# EAGLE design ArduRCT_Remote-v1 (EAGLE 5.07)
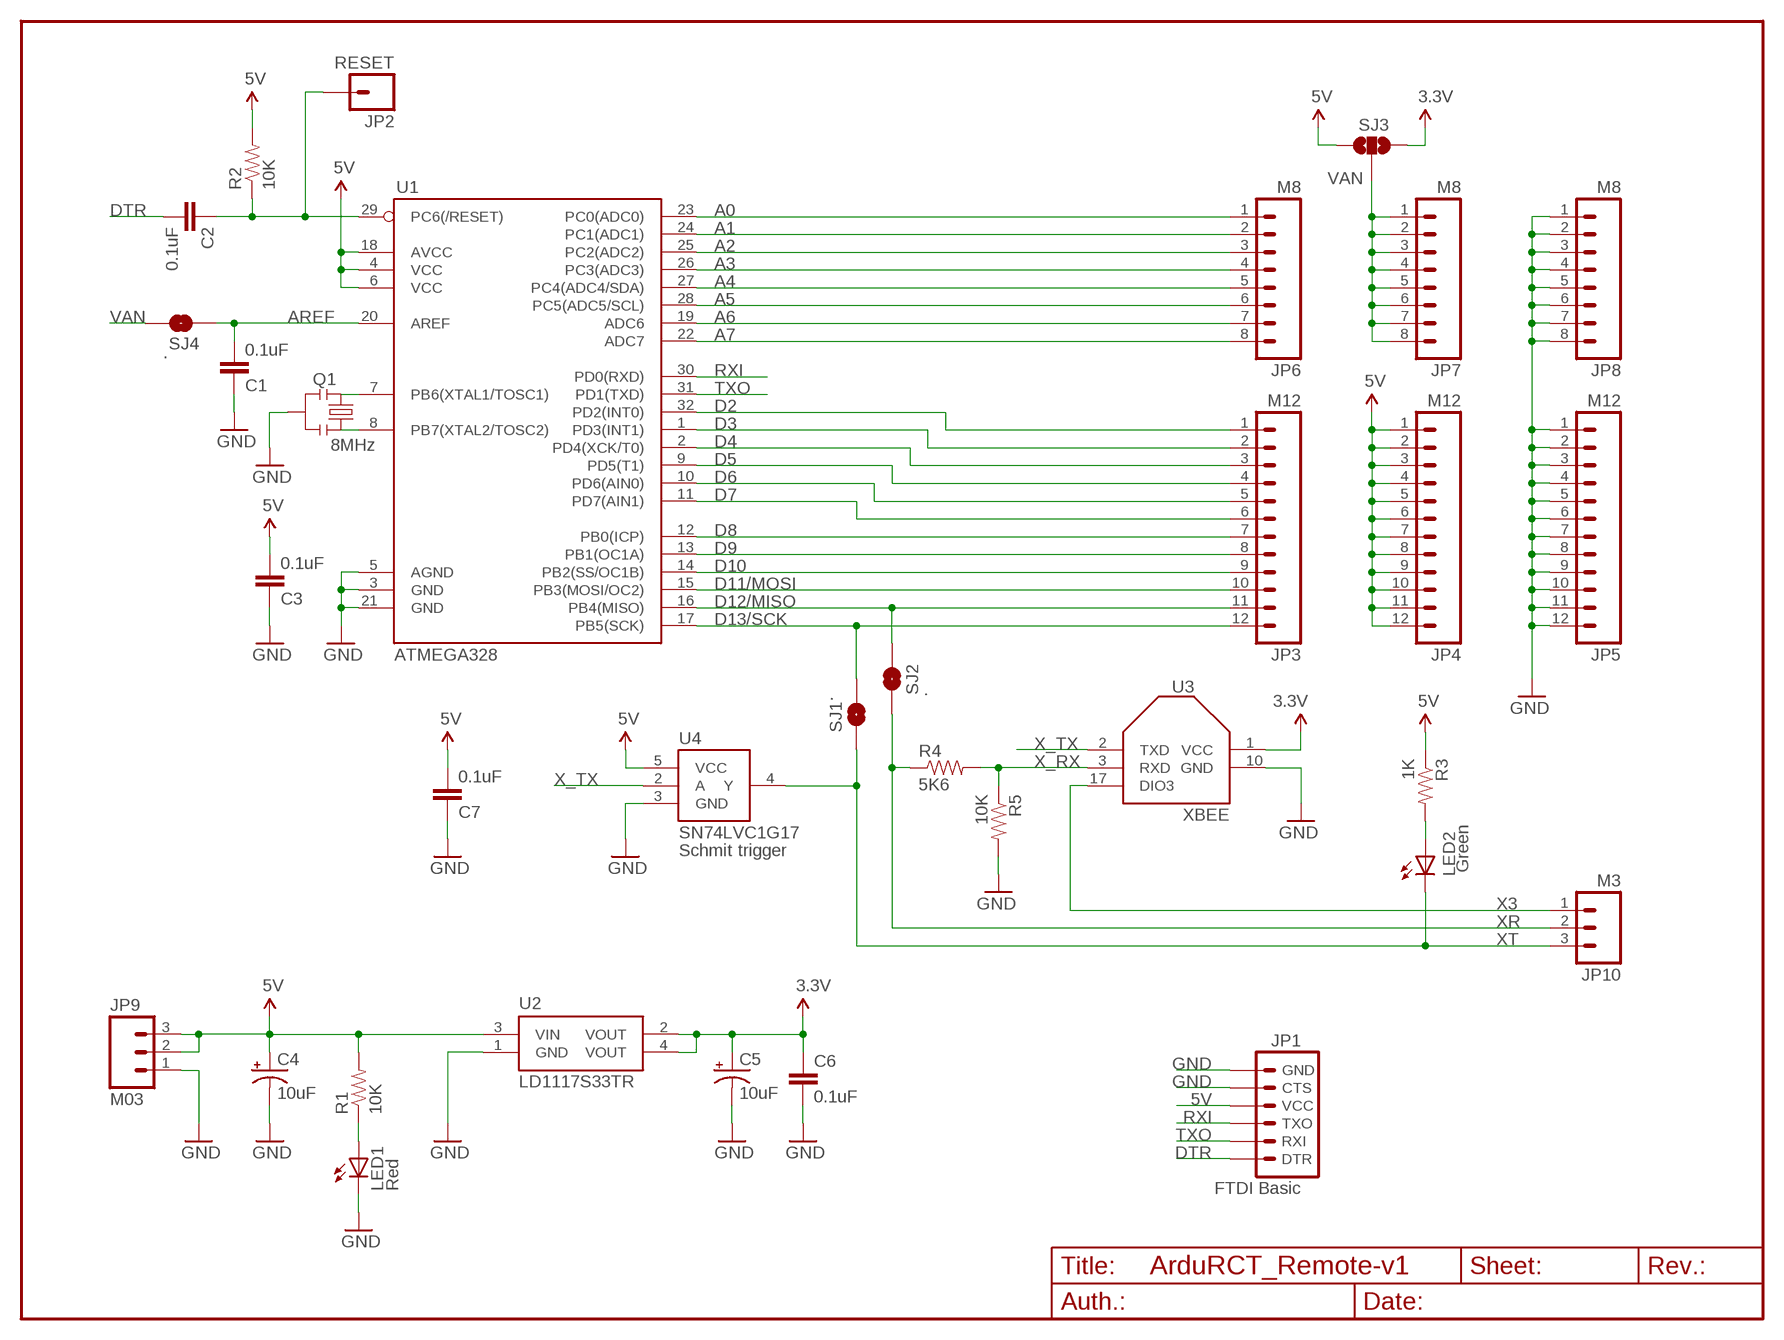
[diagram p0: schematic, sheet 1]

## Parts
C1  0.1uF  CAP0805  [0805]
C2  0.1uF  CAP0805  [0805]
C3  0.1uF  CAP0805  [0805]
C4  10uF  CAP_POL1206  [EIA3216]
C5  10uF  CAP_POL1206  [EIA3216]
C6  0.1uF  CAP0805  [0805]
C7  0.1uF  CAP0805  [0805]
JP1  FTDI Basic  ARDUINO_SERIAL_PROGRAMPTH  [1X06]
JP2  RESET  M01PTH  [1X01]
JP3  M12  M12PTH  [1X12]
JP4  M12  M12PTH  [1X12]
JP5  M12  M12PTH  [1X12]
JP6  M8  M081X08  [1X08]
JP7  M8  M081X08  [1X08]
JP8  M8  M081X08  [1X08]
JP9  M03  [1X3_LONGPAD]
JP10  M3  M03PTH  [1X03]
LED1  Red  LED805  [LED-0805]
LED2  Green  LED805  [LED-0805]
Q1  8MHz  RESONATORSMD  [RESONATOR-SMD]
R1  10K  RESISTOR0805-RES  [0805]
R2  10K  RESISTOR0805-RES  [0805]
R3  1K  RESISTOR0805-RES  [0805]
R4  5K6  RESISTOR0805-RES  [0805]
R5  10K  RESISTOR0805-RES  [0805]
SJ1  .  SOLDERJUMPERTRACE  [SJ_2S-TRACE]
SJ2  .  SOLDERJUMPERTRACE  [SJ_2S-TRACE]
SJ3  SJ_2WAYS_WIDE  [SJ_2WAYS_W]
SJ4  .  SOLDERJUMPERTRACE  [SJ_2S-TRACE]
U1  ATMEGA328  ATMEGA168  [TQFP32-08]
U2  LD1117S33TR  [SOT223]
U3  XBEE  XBEE-SIMPLE  [XBEE-SMD]
U4  SN74LVC1G17  [SOT23-5]

## Nets
3.3V: C5.A(+) C6.1 SJ3.3 U2.2(VOUT) U2.4(VOUT) U3.1(VCC)
5V: C3.2 C4.A(+) C7.2 JP1.4(VCC) JP4.1 JP4.2 JP4.3 JP4.4 JP4.5 JP4.6 JP4.7 JP4.8 JP4.9 JP4.10 JP4.11 JP4.12 JP9.2 JP9.3 R1.2 R2.2 R3.1 SJ3.1 U1.4(VCC) U1.6(VCC) U1.18(AVCC) U2.3(VIN) U4.5(VCC)
A0: JP6.1 U1.23(PC0(ADC0))
A1: JP6.2 U1.24(PC1(ADC1))
A2: JP6.3 U1.25(PC2(ADC2))
A3: JP6.4 U1.26(PC3(ADC3))
A4: JP6.5 U1.27(PC4(ADC4/SDA))
A5: JP6.6 U1.28(PC5(ADC5/SCL))
A6: JP6.7 U1.19(ADC6)
A7: JP6.8 U1.22(ADC7)
AREF: C1.2 SJ4.2 U1.20(AREF)
D2: JP3.1 U1.32(PD2(INT0))
D3: JP3.2 U1.1(PD3(INT1))
D4: JP3.3 U1.2(PD4(XCK/T0))
D5: JP3.4 U1.9(PD5(T1))
D6: JP3.5 U1.10(PD6(AIN0))
D7: JP3.6 U1.11(PD7(AIN1))
D8: JP3.7 U1.12(PB0(ICP))
D9: JP3.8 U1.13(PB1(OC1A))
D10: JP3.9 U1.14(PB2(SS/OC1B))
D11/MOSI: JP3.10 U1.15(PB3(MOSI/OC2))
D12/MISO: JP3.11 SJ2.2 U1.16(PB4(MISO))
D13/SCK: JP3.12 SJ1.1 U1.17(PB5(SCK))
DTR: C2.2 JP1.1(DTR)
GND [vcc]: C1.1 C3.1 C4.C(-) C5.C(-) C6.2 C7.1 JP1.5(CTS) JP1.6(GND) JP5.1 JP5.2 JP5.3 JP5.4 JP5.5 JP5.6 JP5.7 JP5.8 JP5.9 JP5.10 JP5.11 JP5.12 JP8.1 JP8.2 JP8.3 JP8.4 JP8.5 JP8.6 JP8.7 JP8.8 JP9.1 LED1.2(C) Q1.2 R5.2 U1.3(GND) U1.5(AGND) U1.21(GND) U2.1(GND) U3.10(GND) U4.3(GND)
N$1: Q1.1 U1.8(PB7(XTAL2/TOSC2))
N$2: Q1.3 U1.7(PB6(XTAL1/TOSC1))
N$7: LED2.1(A) R3.2
N$38: LED1.1(A) R1.1
RESET: C2.1 JP2.1 R2.1 U1.29(PC6(/RESET))
RXI: JP1.3(TXO) U1.30(PD0(RXD))
TXO: JP1.2(RXI) U1.31(PD1(TXD))
VAN: JP7.1 JP7.2 JP7.3 JP7.4 JP7.5 JP7.6 JP7.7 JP7.8 SJ3.2 SJ4.1
X3: JP10.1 U3.17(DIO3)
X_RX: R4.2 R5.1 U3.3(RXD)
X_TX: U3.2(TXD) U4.2(A)
XR: JP10.2 R4.1 SJ2.1
XT: JP10.3 LED2.2(C) SJ1.2 U4.4(Y)

## Notes on the sheet
- Schmit trigger

## Library data of the parts
C1-C3 C6 C7 = SparkFun:CAP: Capacitor Standard 0603 ceramic capacitor, and 0.1" leaded capacitor.
C4 C5 = SparkFun:CAP_POL: Capacitor Polarized These are standard SMD and PTH capacitors. Normally 10uF, 47uF, and 100uF in electrolytic and tantalum varieties. Always verify the external diameter of the through hole cap, it varies with capacity, voltage, and manufacturer. The EIA devices should be standard.
JP1 = SparkFun:ARDUINO_SERIAL_PROGRAM
JP2 = SparkFun:M01: Header 1 Standard 1-pin 0.1" header. Use with straight break away headers (SKU : PRT-00116), right angle break away headers (PRT-00553), swiss pins (PRT-00743), machine pins (PRT-00117), and female headers (PRT-00115).
JP3-JP5 = SparkFun:M12: Header 12 Standard 12-pin 0.1" header. Use with straight break away headers (SKU : PRT-00116), right angle break away headers (PRT-00553), swiss pins (PRT-00743), machine pins (PRT-00117), and female headers (PRT-00115).
JP6-JP8 = SparkFun:M08: Header 8 Standard 8-pin 0.1" header. Use with straight break away headers (SKU : PRT-00116), right angle break away headers (PRT-00553), swiss pins (PRT-00743), machine pins (PRT-00117), and female headers (PRT-00115).
JP9 = wibauxl:M03
JP10 = SparkFun:M03: Header 3 Standard 3-pin 0.1" header. Use with straight break away headers (SKU : PRT-00116), right angle break away headers (PRT-00553), swiss pins (PRT-00743), machine pins (PRT-00117), and female headers (PRT-00115). Molex polarized connector foot print use with SKU : PRT-08232 with associated crimp pins and housings.
LED1 LED2 = wibauxl:LED
Q1 = SparkFun:RESONATOR: Resonator Small SMD resonator. This is the itty bitty 10/20MHz resonators with built in caps. CSTCE10M0G55 and CSTCE20M0V53. Footprint has been reviewed closely but hasn't been tested yet.
R1-R5 = SparkFun:RESISTOR: Resistor Basic schematic elements and footprints for 0603, 1206, and PTH resistors.
SJ1 SJ2 SJ4 = SparkFun:SOLDERJUMPER: Solder Jumper Standard SMD solder jumper. Used to automate production. Two varients : Normally Open and Normally Closed are the same, but have different paste layers. NC will have a large amount of paste and should jumper during reflow.
SJ3 = wibauxl:SJ_2WAYS
U1 = SparkFun:ATMEGA168
U2 = wibauxl:LD1117S33TR
U3 = wibauxl:XBEE-SIMPLE
U4 = wibauxl:SN74LVC1G17

## Net classes
0 default: width 0.203 mm
1 vcc: width 0.254 mm

## Board
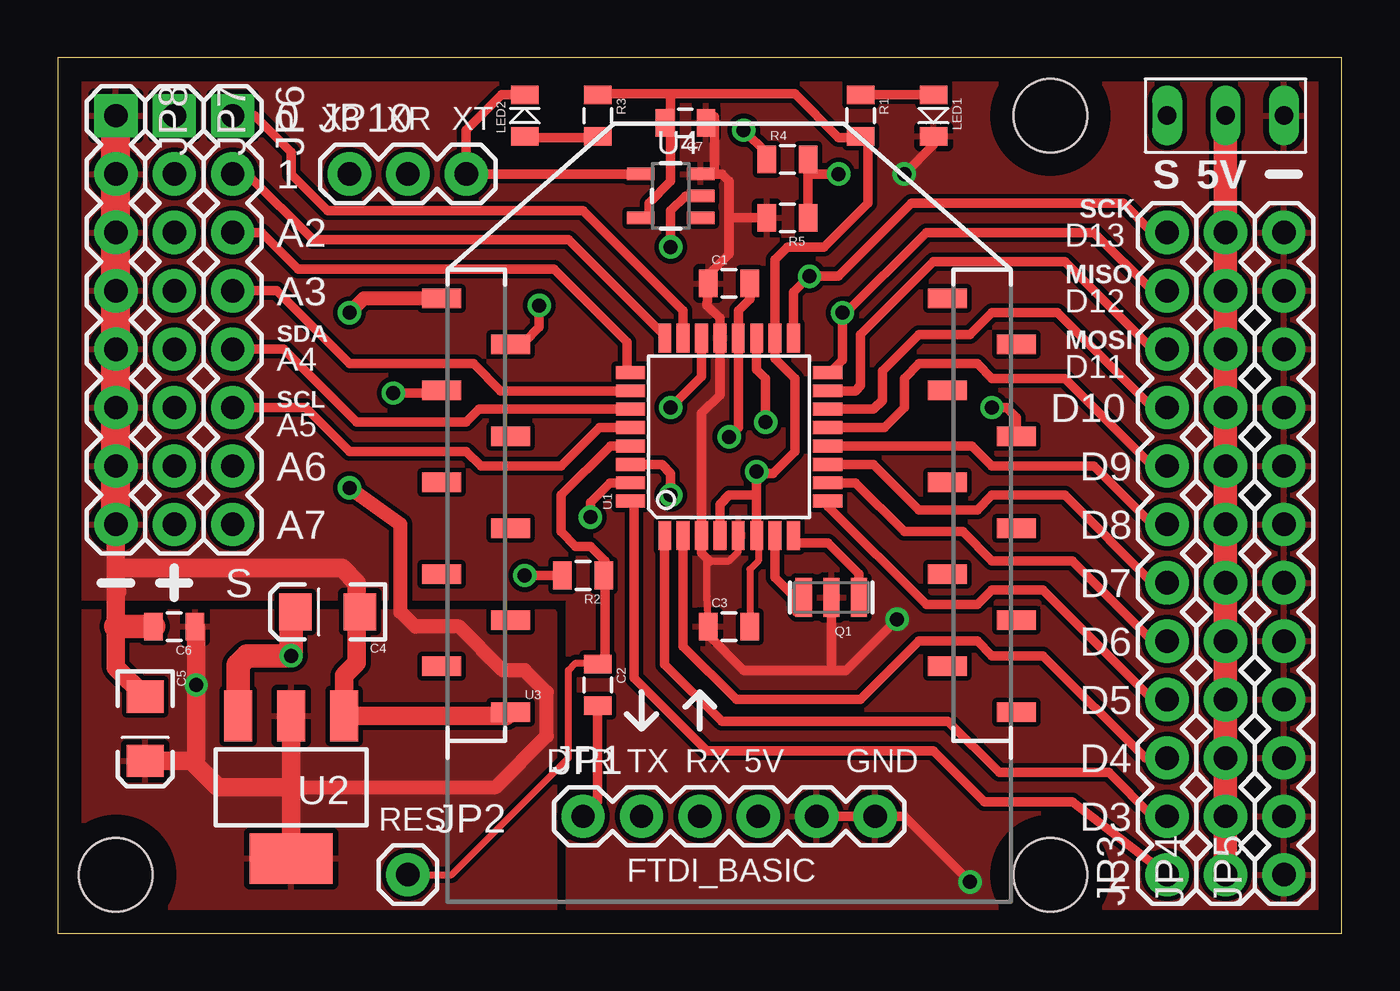
[diagram p1: board, top side]
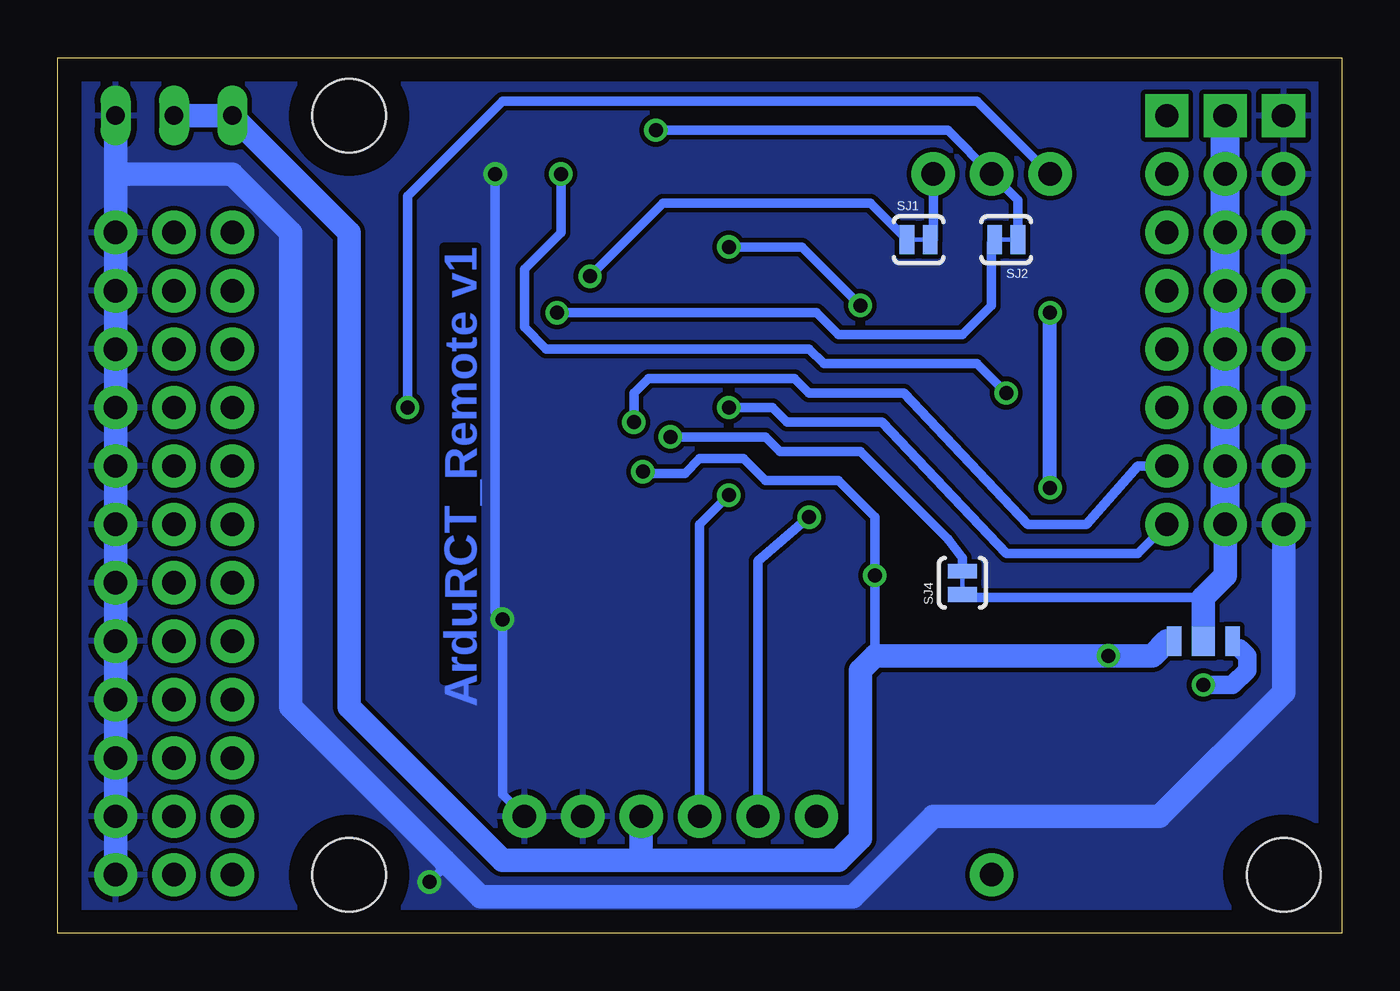
[diagram p2: board, bottom side, seen from below]

Size 55.87 x 38.09 mm. Coordinates in mm from the lower left corner, seen from the top.
Outline: 0,0 55.87,0 55.87,38.09 0,38.09 0,0
Copper layers (1*16): Top 0.035mm / dielectric 1.5mm / Bottom 0.035mm
Design rules "default": minimum track width 10mil, minimum drill 24mil, track to track 8mil, track to pad 8mil, pad to pad 8mil, via to via 8mil, smd to smd 8mil, copper to edge 40mil, drill to drill 8mil, minimum pad ring 10mil, minimum via ring 8mil, stop-mask expansion 4mil, vias tented up to drill 0mil, thermal gap 10mil
Holes 3.2 mm at 43.18,35.56 2.54,2.54 43.18,2.54

### Footprints (pad centres in the part's own frame; a part is rotated, then mirrored left to right if it is on the bottom)
0805 = smd 0.8 x 1.2: 1 -0.9,0; 2 0.9,0
EIA3216 = smd 1.4 x 1.6: A 1.4,0; C -1.4,0
1X06 = drill 1.016 pad 1.88 round: 1 0,0; 2 2.54,0; 3 5.08,0; 4 7.62,0; 5 10.16,0; 6 12.7,0
1X01 = drill 1.016 pad 1.88 round: 1 0,0
1X12 = drill 1.016 pad 1.88 round: 1 0,0; 2 2.54,0; 3 5.08,0; 4 7.62,0; 5 10.16,0; 6 12.7,0; 7 15.24,0; 8 17.78,0; 9 20.32,0; 10 22.86,0; 11 25.4,0; 12 27.94,0
1X08 = drill 1.016 pad 1.88 square: 1 0,0 | drill 1.016 pad 1.88 round: 2 2.54,0; 3 5.08,0; 4 7.62,0; 5 10.16,0; 6 12.7,0; 7 15.24,0; 8 17.78,0
1X3_LONGPAD = drill 0.8 pad 1.27 long: 1 0,0; 2 -2.54,0; 3 -5.08,0
1X03 = drill 1.016 pad 1.88 round: 1 0,0; 2 2.54,0; 3 5.08,0
LED-0805 = smd 0.8 x 1.2: 1 -0.9,0; 2 0.9,0
RESONATOR-SMD = smd 0.7 x 1.7: 1 -1.2,0; 2 0,0; 3 1.2,0
SJ_2S-TRACE = smd 0.635 x 1.27: 1 -0.508,0; 2 0.508,0
SJ_2WAYS_W = smd 0.635 x 1.27: 1 -1.27,0; 3 1.27,0 | smd 1.016 x 1.27: 2 0,0
TQFP32-08 = smd 1.27 x 0.559: 1 -4.293,2.8; 2 -4.293,2; 3 -4.293,1.2; 4 -4.293,0.4; 5 -4.293,-0.4; 6 -4.293,-1.2; 7 -4.293,-2; 8 -4.293,-2.8; 17 4.293,-2.8; 18 4.293,-2; 19 4.293,-1.2; 20 4.293,-0.4; 21 4.293,0.4; 22 4.293,1.2; 23 4.293,2; 24 4.293,2.8 | smd 0.559 x 1.27: 9 -2.8,-4.293; 10 -2,-4.293; 11 -1.2,-4.293; 12 -0.4,-4.293; 13 0.4,-4.293; 14 1.2,-4.293; 15 2,-4.293; 16 2.8,-4.293; 25 2.8,4.293; 26 2,4.293; 27 1.2,4.293; 28 0.4,4.293; 29 -0.4,4.293; 30 -1.2,4.293; 31 -2,4.293; 32 -2.8,4.293
SOT223 = smd 1.219 x 2.235: 1 -2.311,-3.099; 2 0,-3.099; 3 2.311,-3.099 | smd 3.6 x 2.2: 4 0,3.099
XBEE-SMD = smd 1.7 x 0.85: 1 -12.5,20; 2 -9.5,18; 3 -12.5,16; 4 -9.5,14; 5 -12.5,12; 6 -9.5,10; 7 -12.5,8; 8 -9.5,6; 9 -12.5,4; 10 -9.5,2; 11 12.5,2; 12 9.5,4; 13 12.5,6; 14 9.5,8; 15 12.5,10; 16 9.5,12; 17 12.5,14; 18 9.5,16; 19 12.5,18; 20 9.5,20
SOT23-5 = smd 0.55 x 1.2: 1 -0.95,-1.3; 2 0,-1.3; 3 0.95,-1.3; 4 0.95,1.3; 5 -0.95,1.3

### Placement (x,y rotation side)
C1  29.21,28.26 0 top
C2  23.5,10.79 270 top
C3  29.21,13.34 0 top
C4  11.75,13.97 180 top
C5  3.81,8.89 270 top
C6  5.08,13.34 180 top
C7  27.3,35.24 180 top
JP1  22.86,5.08 0 top
JP2  15.24,2.54 0 top
JP3  48.26,2.54 90 top
JP4  50.8,2.54 90 top
JP5  53.34,2.54 90 top
JP6  7.62,35.56 270 top
JP7  5.08,35.56 270 top
JP8  2.54,35.56 270 top
JP9  53.34,35.56 0 top
JP10  12.7,33.02 0 top
LED1  38.1,35.56 270 top
LED2  20.32,35.56 90 top
Q1  33.66,14.61 180 top
R1  34.92,35.56 270 top
R2  22.86,15.56 180 top
R3  23.5,35.56 270 top
R4  31.75,33.66 0 top
R5  31.75,31.11 180 top
SJ1  18.41,30.16 0 bottom
SJ2  14.61,30.16 180 bottom
SJ3  6.03,12.7 0 bottom
SJ4  16.51,15.24 90 bottom
U1  29.21,21.59 90 top
U2  10.16,6.35 180 top
U3  29.21,7.62 0 top
U4  26.67,32.07 90 top

### Tracks (layer width: path | path; a pad name or v marks a point on that pad's centre or on a via)
3.3V  (via drill 0.61)
  Top 0.406: 10.16,6.67 10.48,6.35
  Top 0.61: U3.1 13.33,27.62 v12.7,26.99 | v12.7,19.37 14.92,17.78 14.92,13.97 15.56,13.34 17.46,13.34 19.37,11.43 20.32,11.43 21.27,10.48 21.27,8.57 19.05,6.35 10.48,6.35
  Top 0.813: 5.84,7.49 6.99,6.35 10.16,6.35 | 10.16,6.35 10.16,6.67 U2.2 | 10.16,6.35 U2.4 | C5.A 5.84,7.49 | 5.84,7.49 5.9,7.49 6.03,7.62 v6.03,10.79 6.03,13.28 C6.1
  Bottom 0.406: 4.45,12.38 SJ3.3
  Bottom 0.61: v12.7,19.37 v12.7,26.99
  Bottom 0.813: v6.03,10.79 4.76,10.79 4.13,11.43 4.13,12.06 4.45,12.38
  pour Top: 0.64,13.97 21.59,13.97 21.59,0.64 0.64,0.64
5V  (via drill 0.61)
  Top 0.305: C3.2 30.11,15.82 30.48,16.19 30.48,17.23 U1.6
  Top 0.406: U4.5 25.72,31.12 25.72,31.75 26.67,32.7 26.67,35.24 | 26.67,35.24 26.67,36.2 | 26.67,35.24 C7.2 26.67,35.3 26.67,36.51 | R3.1 23.5,36.51 26.67,36.51 | 26.67,36.51 32.07,36.51 33.97,34.61 34.92,34.61 R1.2 | R1.2 34.98,34.66 | R1.2 35.24,34.61 35.24,31.75 33.34,29.84 31.75,29.84 31.21,29.3 U1.18 31.21,24.99 32.07,24.13 32.07,20.95 31.11,20 30.48,20 v30.41,20.07 30.41,19.05 | U1.4 28.81,18.65 29.21,19.05 30.41,19.05 | 30.41,19.05 U1.6 | v20.32,15.56 R2.2
  Top 1.016: JP4.1 JP4.2 JP4.3 JP4.4 JP4.5 JP4.6 JP4.7 JP4.8 JP4.9 JP4.10 JP4.11 JP4.12 JP9.2 | C4.A 10.48,13.97 10.16,13.65 v10.16,12.06 8.26,12.06 7.85,11.66 U2.3
  Bottom 0.406: v30.41,20.07 30.48,20 28.57,20 27.94,20.64 26.04,20.64 25.08,19.68 21.91,19.68 20.32,18.1 v20.32,15.56 20.32,12.06 19.05,11.75
  Bottom 0.61: 7.62,12.7 SJ3.1
  Bottom 1.016: JP9.2 JP9.3 43.18,30.48 43.18,9.84 36.51,3.17 30.48,3.17 | 30.48,3.17 JP1.4 | 30.48,3.17 21.91,3.17 20.95,4.13 20.95,11.43 20.32,12.06 v10.16,12.06 8.26,12.06 7.62,12.7
A0
  Top 0.406: U1.23 27.21,27.08 22.86,31.43 11.75,31.43 10.16,33.02 10.16,33.97 8.57,35.56 JP6.1
A1
  Top 0.406: U1.24 26.35,25.94 26.35,26.04 22.23,30.16 11.11,30.16 8.26,33.02 JP6.2
A2
  Top 0.406: U1.25 24.77,24.54 24.77,25.72 21.59,28.89 10.48,28.89 8.89,30.48 JP6.3
A3
  Top 0.406: U1.26 19.27,23.59 18.1,24.77 12.7,24.77 9.53,27.94 JP6.4
A4
  Top 0.406: JP6.5 9.84,25.4 13.02,22.23 17.78,22.23 18.34,22.79 U1.27
A5
  Top 0.406: U1.28 23.58,21.99 21.91,20.32 18.41,20.32 17.78,20.95 12.7,20.95 10.79,22.86 JP6.6
A6  (via drill 0.61)
  Top 0.406: U1.19 30.41,24.52 30.8,24.13 v30.8,22.23
  Bottom 0.406: v30.8,22.23 30.8,23.5 30.16,24.13 23.81,24.13 23.18,23.5 19.05,23.5 13.65,17.78 11.11,17.78 8.89,20.32 JP6.7
A7  (via drill 0.61)
  Top 0.406: U1.22 28.01,24.2 v26.67,22.86
  Bottom 0.406: v26.67,22.86 24.77,22.86 24.13,22.23 20,22.23 14.61,16.51 8.89,16.51 JP6.8
AREF  (via drill 0.61)
  Top 0.406: C1.2 30.11,27.57 29.61,27.07 U1.20 29.61,21.99 v29.21,21.59
  Bottom 0.406: v29.21,21.59 25.08,21.59 24.45,20.95 20.95,20.95 17.14,17.14 16.51,16.32 SJ4.2
D2
  Top 0.406: JP3.1 44.13,5.71 40.32,5.71 38.1,7.94 28.26,7.94 25.08,11.11 25.08,18.62 U1.32
D3
  Top 0.406: JP3.2 47.62,5.08 45.72,6.99 40.96,6.99 38.73,9.21 28.89,9.21 26.41,11.69 U1.1
D4
  Top 0.406: U1.2 27.21,12.48 29.53,10.16 34.92,10.16 37.47,12.7 40.01,12.7 40.64,12.06 42.86,12.06 47.31,7.62 JP3.3
D5
  Top 0.406: U1.9 33.5,18.57 37.78,14.29 40.01,14.29 40.64,14.92 42.86,14.92 47.62,10.16 JP3.4
D6
  Top 0.406: U1.10 34.7,19.59 36.83,17.46 39.37,17.46 40.64,16.19 44.13,16.19 47.62,12.7 JP3.5
D7
  Top 0.406: U1.11 35.49,20.39 37.47,18.41 40.01,18.41 40.64,19.05 43.81,19.05 47.62,15.24 JP3.6
D8
  Top 0.406: U1.12 39.77,21.19 40.64,20.32 45.09,20.32 47.62,17.78 JP3.7
D9
  Top 0.406: U1.13 35.96,21.99 36.83,22.86 36.83,24.13 37.47,24.77 40.01,24.77 40.64,24.13 43.81,24.13 47.62,20.32 JP3.8
D10
  Top 0.406: U1.14 35.49,22.79 35.88,23.18 35.88,24.45 37.47,26.04 39.69,26.04 40.64,26.99 43.5,26.99 47.62,22.86 JP3.9
D11/MOSI
  Top 0.406: U1.15 34.7,23.59 34.92,23.81 34.92,26.04 38.1,29.21 43.81,29.21 47.62,25.4 JP3.10
D12/MISO  (via drill 0.61)
  Top 0.406: U1.16 33.66,24.45 34.14,24.93 v34.14,26.99 34.14,26.84 37.78,30.48 45.09,30.48 47.62,27.94 JP3.11
  Bottom 0.406: v34.14,26.99 22.86,26.99 21.91,26.04 16.51,26.04 15.24,27.3 15.24,30.04 SJ2.2
D13/SCK  (via drill 0.61)
  Top 0.406: JP3.12 47.62,30.48 46.35,31.75 37.15,31.75 33.97,28.57 v32.7,28.57 32.01,27.88 U1.17
  Bottom 0.406: v32.7,28.57 29.53,31.75 20.51,31.75 SJ1.1
DTR
  Top 0.406: JP1.1 23.5,5.71 C2.2
GND  (via drill 0.61)
  Top 0.305: U1.5 29.61,16.59 29.21,16.19 28.36,16.19 28.26,16.19 28.26,14.66 C3.1
  Top 0.406: JP1.5 JP1.6 36.83,5.08 v39.69,2.22 | 33.66,11.43 34.29,11.43 v36.51,13.65 | 33.66,11.43 Q1.2 | 33.66,11.43 29.84,11.43 28.31,12.96 C3.1 | 28.31,16.14 28.36,16.19 28.01,16.55 U1.3 28.01,22.61 28.81,23.41 U1.21 28.81,26.75 28.26,27.3 C1.1 28.26,28.63 28.26,28.57 29.21,29.53 29.21,31.11 | C7.1 28.57,35.51 28.57,33.02 28.29,33.05 U4.3 28.89,33.02 29.21,32.7 29.21,31.11 | 29.21,31.11 R5.2 | LED1.2 38.1,34.29 v36.83,33.02
  Top 0.813: U2.1 19.54,9.45 U3.10 | 2.54,14.92 2.54,13.34 2.54,11.56 C5.C | 2.54,14.92 2.54,15.88 | 2.54,15.88 JP8.8 | 2.54,14.92 2.59,14.87 | U2.1 14.53,9.45 | 2.54,15.88 12.38,15.88 13.02,15.24 13.02,14.1 C4.C 13.02,13.84 13.02,11.75 12.47,11.2 U2.1
  Top 1.016: 2.54,13.34 C6.2
  Top 1.27: JP8.1 JP8.2 JP8.3 JP8.4 JP8.5 JP8.6 JP8.7 JP8.8
  Bottom 0.406: JP1.6 36.51,6.03 v36.51,13.65 36.83,13.97 v36.83,33.02 | 39.05,3.17 39.05,2.86 v39.69,2.22
  Bottom 1.016: JP5.1 JP5.2 JP5.3 JP5.4 JP5.5 JP5.6 JP5.7 JP5.8 JP5.9 JP5.10 JP5.11 JP5.12 53.34,33.02 | 53.34,33.02 48.26,33.02 45.72,30.48 45.72,9.84 39.05,3.17 37.47,1.59 21.27,1.59 17.78,5.08 7.94,5.08 2.54,10.48 JP8.8 | 53.34,33.02 JP9.1
  pour Top: 0.64,14.61 22.23,14.61 22.23,0.64 55.24,0.64 55.24,37.47 0.64,37.47
  pour Bottom: 0.64,37.47 0.64,0.64 55.24,0.64 55.24,37.47
N$1
  Top 0.406: U1.8 32.07,17.14 32.23,16.98 33.5,16.98 34.85,15.63 Q1.1
N$2
  Top 0.406: U1.7 31.21,15.46 32.07,14.61 32.14,13.97 Q1.3
N$7
  Top 0.406: R3.2 23.18,34.61 20.37,34.61 LED2.1
N$38
  Top 0.406: R1.1 LED1.1
RESET
  Top 0.305: JP2.1 17.14,2.54 22.23,7.62 22.23,11.43 22.54,11.75 23.44,11.75
  Top 0.406: U1.29 24.05,21.19 21.91,19.05 21.91,17.46 22.54,16.83 23.18,16.83 23.81,16.19 23.76,15.93 R2.1 23.81,14.92 23.81,12.06 C2.1 23.44,11.75
RXI  (via drill 0.61)
  Top 0.406: v26.67,19.05 26.67,20 26.28,20.39 U1.30
  Bottom 0.406: v26.67,19.05 27.94,17.78 JP1.3
TXO  (via drill 0.61)
  Top 0.406: U1.31 24.04,19.59 23.18,18.73 v23.18,18.1
  Bottom 0.406: JP1.2 25.4,16.19 v23.18,18.1
VAN
  Bottom 0.406: 6.03,14.61 16.19,14.61 16.19,14.73 SJ4.1
  Bottom 1.016: SJ3.2 6.03,14.61 5.08,15.56 JP7.8
  Bottom 1.27: JP7.1 JP7.2 JP7.3 JP7.4 JP7.5 JP7.6 JP7.7 JP7.8
X3  (via drill 0.61)
  Top 0.406: U3.17 41.71,22.43 41.27,22.86 v40.64,22.86
  Bottom 0.406: v40.64,22.86 40.64,32.07 36.51,36.2 15.88,36.2 JP10.1
X_RX  (via drill 0.61)
  Top 0.406: v33.97,33.02 32.7,33.02 32.7,33.39 R4.2 R5.1 | v14.61,23.5 16.59,23.5 U3.3
  Bottom 0.406: v33.97,33.02 33.97,30.48 35.56,28.89 35.56,26.35 34.61,25.4 23.18,25.4 22.54,24.77 15.88,24.77 v14.61,23.5
X_TX  (via drill 0.61)
  Top 0.406: U4.2 27.3,32.07 26.67,31.43 v26.67,29.84 | v20.95,27.3 20.95,26.35 20.32,25.72 19.81,25.72 U3.2
  Bottom 0.406: v26.67,29.84 23.5,29.84 v20.95,27.3
XR  (via drill 0.61)
  Top 0.406: R4.1 30.85,33.92 v29.84,34.92
  Bottom 0.406: 13.97,30.16 SJ2.1 14.1,31.88 JP10.2 17.14,34.92 v29.84,34.92
XT
  Top 0.406: LED2.2 19.32,36.46 17.78,34.92 JP10.3 U4.4
  Bottom 0.406: JP10.3 17.78,30.29 SJ1.2 17.78,30.16

### Text on the board
Bottom: ArduRCT_Remote v1
tPlace: 0 | X3 | XR | XT | 1 | S | 5V | SCK | A2 | D13 | MISO | A3 | D12 | SDA | MOSI | A4 | D11 | SCL | A5 | D10 | A6 | D9 | A7 | D8 | S | D7 | D6 | D5 | DTR | TX | RX | 5V | GND | D4 | RES | D3 | FTDI_BASIC | 2